# EAGLE design Adafruit TCS34725 (EAGLE 6.2)
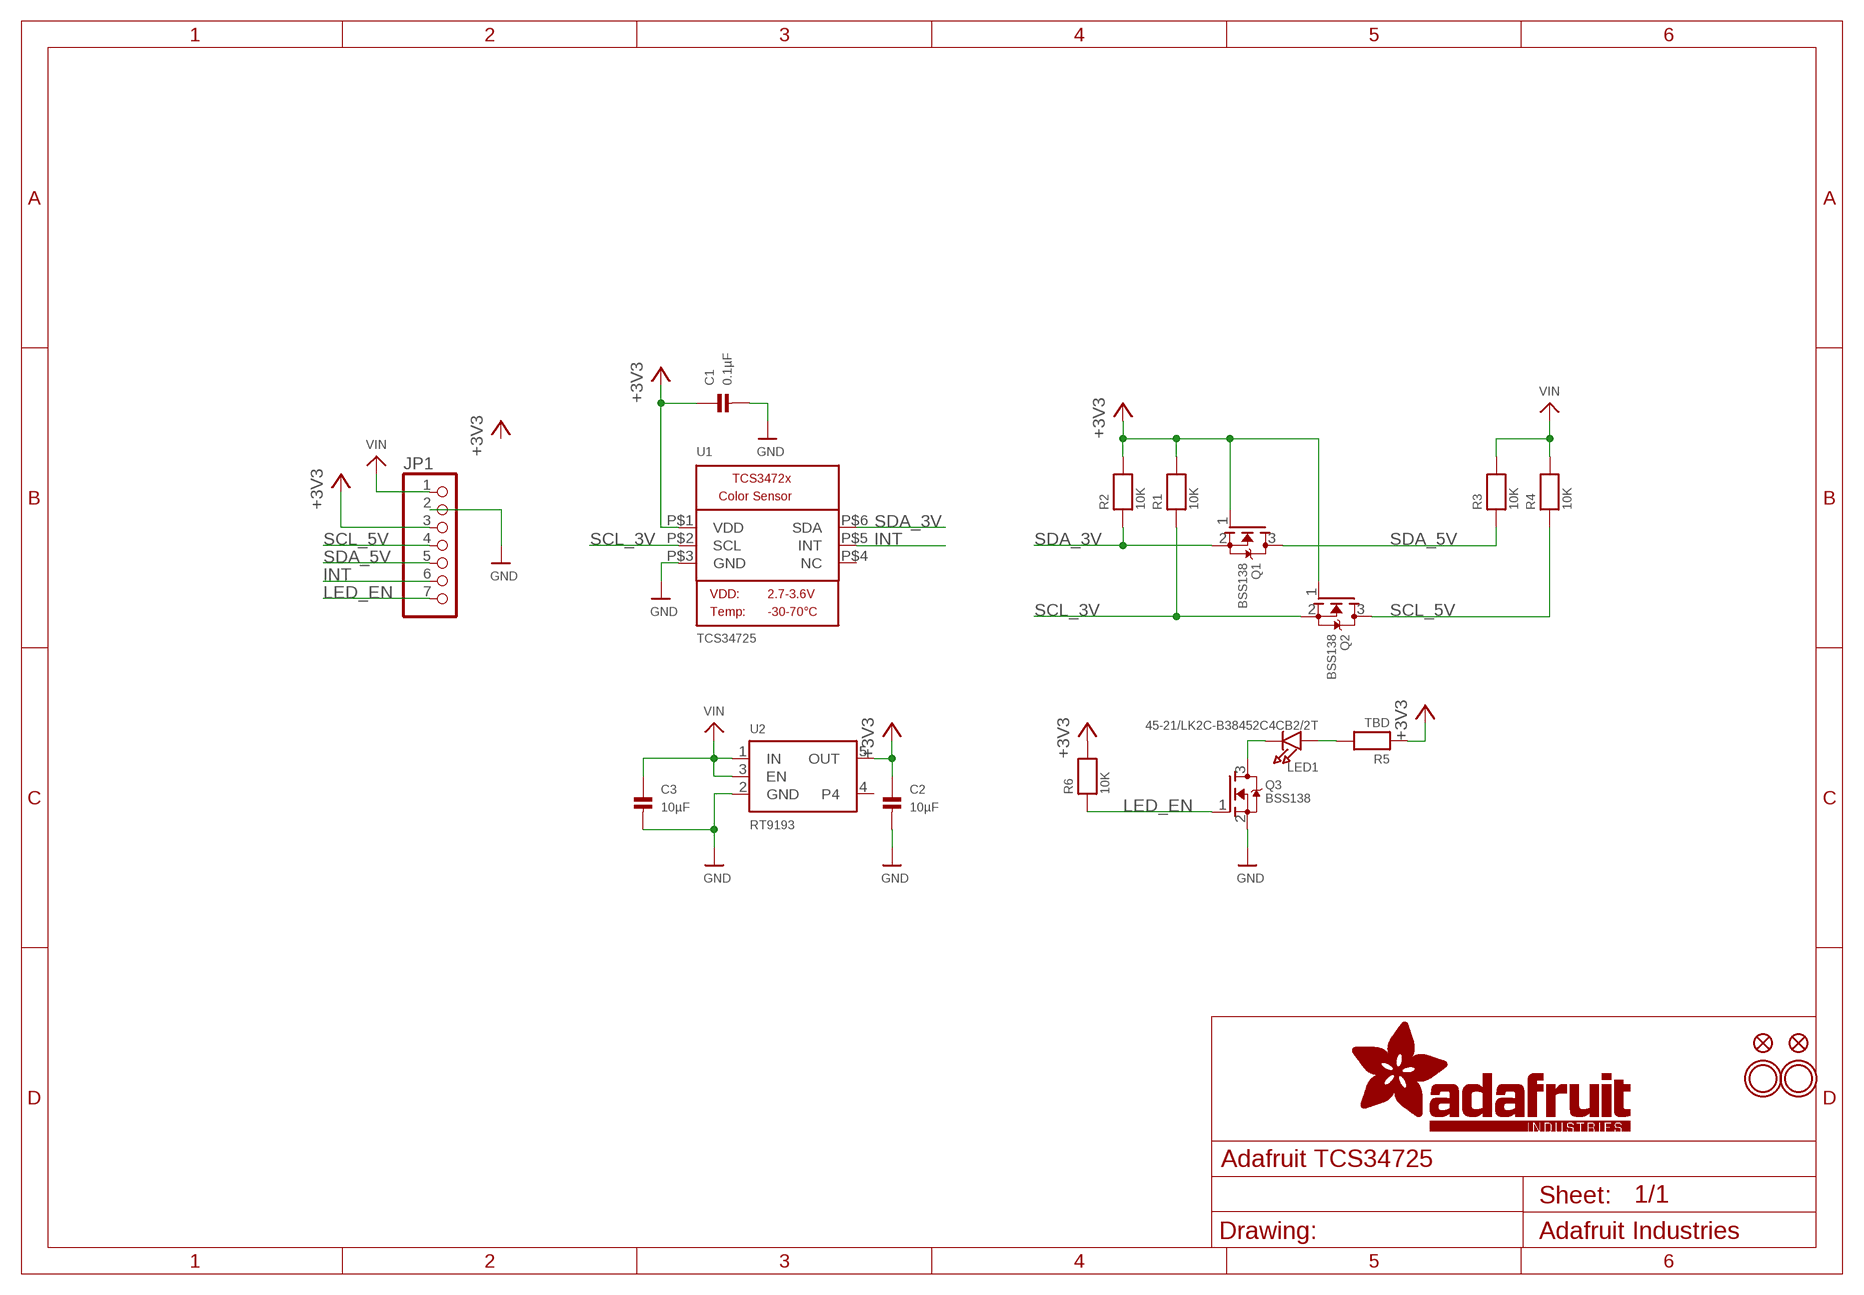
[diagram p0: schematic, sheet 1]

## Parts
C1  0.1µF  CAP_CERAMIC_0805  [_0805]
C2  10µF  CAP_CERAMIC_0805  [_0805]
C3  10µF  CAP_CERAMIC_0805  [_0805]
FID1  FIDUCIAL""  [FIDUCIAL_1MM]
FID2  FIDUCIAL""  [FIDUCIAL_1MM]
JP1  HEADER-1X770MIL  [1X07_ROUND_70]
LED1  45-21/LK2C-B38452C4CB2/2T  LEDEV45-21  [EVERLIGHT_45-21]
Q1  BSS138  MOSFET-NWIDE  [SOT23-WIDE]
Q2  BSS138  MOSFET-NWIDE  [SOT23-WIDE]
Q3  BSS138  MOSFET-NWIDE  [SOT23-WIDE]
R1  10K  RESISTOR_0805  [_0805]
R2  10K  RESISTOR_0805  [_0805]
R3  10K  RESISTOR_0805  [_0805]
R4  10K  RESISTOR_0805  [_0805]
R5  TBD  RESISTOR_0805  [_0805]
R6  10K  RESISTOR_0805  [_0805]
U1  TCS34725  LIGHT_TCS3472  [TCS3472_FN6]
U2  RT9193  VREG_SOT23-5  [SOT23-5]
U$8  MOUNTINGHOLE2.5  [MOUNTINGHOLE_2.5_PLATED]
U$14  MOUNTINGHOLE2.5  [MOUNTINGHOLE_2.5_PLATED]

## Nets
+3V3: C1.1 C2.1 JP1.3 Q1.1(G) Q2.1(G) R1.2 R2.2 R5.1 R6.2 U1.P$1(VDD) U2.5(OUT)
GND: C1.2 C2.2 C3.2 JP1.2 Q3.2(S) U1.P$3(GND) U2.2(GND)
INT: JP1.6 U1.P$5(INT)
LED_EN: JP1.7 Q3.1(G) R6.1
N$1: LED1.K(C) Q3.3(D)
N$2: LED1.A R5.2
SCL_3V: Q2.2(S) R1.1 U1.P$2(SCL)
SCL_5V: JP1.4 Q2.3(D) R4.1
SDA_3V: Q1.2(S) R2.1 U1.P$6(SDA)
SDA_5V: JP1.5 Q1.3(D) R3.1
VIN: C3.1 JP1.1 R3.2 R4.2 U2.1(IN) U2.3(EN)
Unconnected: U1.P$4(NC) U2.4

## Library data of the parts
C1-C3 = microbuilder:CAP_CERAMIC: Ceramic Capacitors 0402 - 0402 Surface Mount Capacitors 16pF 50V 5% [Digikey: 445-4899-2-ND] 18pF 50V 5% [Digikey: 490-1281-2-ND] 22pF 50V 5% [Digikey: 490-1283-2-ND] 68pF 50V 5% [Digikey: 490-1289-2-ND] 0.1uF 10V 10% [Digikey: 490-1318-2-ND] 1.0uF 6.3V 10% [Digikey: 490-1320-2-ND] 0603 - 0603 Surface Mount Capacitors 16 pF 50V 5% [Digikey: 445-5051-2-ND] 22 pF 50V [Digikey: PCC220ACVTR-ND] 33 pF 50V 5% [Digikey: 490-1415-1-ND] 56pF 50V 5% [Digikey: 490-1421-1-ND] 220pF 50V 5% [Digikey: 445-1285-1-ND] 680 pF 50V 2200 pF 50V 5% C0G [Digikey: 445-1297-1-ND] 5600 pF 100V 5% X7R [Digikey: 478-3711-1-ND] 0.1 µF 25V 10% [Digikey: PCC2277TR-ND] 0.22 µF 16V 10% X7R [Digikey: 445-1318-1-ND] 1.0 µF 25V 10% [Digikey: 445-5146-2-ND] 0603 - RF Specific 3pF 250V +/-0.1pF RF [Digikey: 712-1347-1-ND] 18 pF 250V 5% [Digikey: 478-3505-1-ND or 712-1322-1-ND] 56 pF 250V 5% C0G RF [Digikey: 490-4867-1-ND] 68 pF 250V RF [Digikey: 490-4868-1-ND] 0805 - 0805 Surface Mount Capacitors 220 pF 250V 2% RF Ceramic Capacitor [Digikey: 712-1398-1-ND] 1000 pF 50V 2% NP0 Ceramic Capacitor [Digikey: 478-3760-1-ND] 0.1 µF 25V 10% Ceramic Capacitor [Digikey: PCC1828TR-ND] 1.0 µF 16V 10% Ceramic Capacitor[Digikey: 490-1691-2-ND] 10.0 µF 10V 10% Ceramic Capacitor[Digikey: 709-1228-1-ND] 10.0 uF 16V 10% Ceramic Capacitor [Digikey: 478-5165-2-ND] 47 uF 6.3V 20% Ceramic Capacitor [Digikey: 587-1779-1-ND or 399-5506-1-ND] 1206 - 1206 Surface Mount Capacitors 47uF 10V 20% Ceramic Capacitor [Digikey: 490-5528-1-ND or 399-5508-1-ND or 445-6010-1-ND] 100uF 6.3V -20%, +80% Y5V Ceramic Capacitor (Digikey: 490-4512-1-ND, Mouser: 81-GRM31CF50J107ZE1L)
FID1 FID2 = microbuilder:FIDUCIAL: Fiducial Alignment Points Various fiducial points for machine vision alignment.
JP1 = microbuilder:HEADER-1X7: PIN HEADER
LED1 = microbuilder:LED: LED 0603 - 0603 Surface Mount Package 2mA: Green LED - Low Power (3.9mcd, 2ma, 1.7Vf) - Digikey: 475-2709-2-ND Orange LED - Low Power (9.8mcd, 2ma, 1.8Vf) - Digikey: 475-1194-2-ND Red LED - Low Power (5mcd, 2ma, 1.8Vf) - Digikey: 475-1195-2-ND Yellow LED - Low Power (7mcd, 2ma, 1.8Vf) - Digikey: 475-1196-2-ND 5mA: Blue LED - Low Power (17mcd, 5ma, 2.9Vf) - Digikey: LNJ937W8CRACT-ND 0805 - 0805 Surface Mount Package 2mA: Red LED (8.8mcd, 2mA, 1.8Vf, Clear) - Low Power [Digikey: 475-2510-1-ND] Green LED (5mcd, 2mA, 1.8Vf, Clear) - Low Power [Digikey: 475-2730-1-ND] Yellow LED (11.3mcd, 2mA, 1.8Vf, Clear) - Low Power [Digikey: 475-2555-1-ND] 20mA: Red LED (104mcd, 20mA, Diffused) - LS R976 [Digikey: 475-1278-6-ND] Red LED (12mcd, 20mA, 2.0Vf, Clear) - APT2012EC [Digikey: 754-1128-1-ND] Green LED (15mcd, 20mA, 2.2Vf, Clear) - APT2012GC [Digikey: 754-1131-1-ND] Orange LED (160mcd, 20mA, 2.1Vf, Clear) - APT2012SECK [Digikey: 754-1130-1-ND] 1206 - 1206 Surface Mount Package Green LED (26mcd, 20mA, Diffused) - LG N971 [Digikey: 475-1407-6-ND] Red LED (15mcd, 20mA, Diffused) - LH N974 [Digikey: 475-1416-6-ND] Cree - Cree High-Power Surface Mount LEDs XPEBWT-L1-0000-00D50 - White 111lm 350mA 2.9Vf 6200K 110° XTEAWT-00-0000-00000LEE3 - White 114lm 350mA 2.85Vf 5000K 115° Everlight - Everlight 45-21 Series Surface Mount LEDs 45-21/QK2C-B2832AC2CB2/2T - Warm White 2000mcd 20mA 3.25Vf 3050K 120° 45-21/LK2C-B38452C4CB2/2T - Nuetral White 2000mcd 20mA 3.25Vf 4150K 120° 45-21/LK2C-B50634C6CB2/2T - Cold White 2200mcd 20mA 3.25Vf 5650K 120°
Q1-Q3 = microbuilder:MOSFET-N: N-Channel Mosfet LEGEND VDS: Voltage Drain-Source ID: Drain Current RDS(ON): Drain-Source On-State Resistance VGS(TH): Gate-Source Threshold Voltage CISS: Drain-Source Input Capacitance SOT-23 Name VDS ID RDS(ON) VGS(TH) CISS Order Number 2N7002E 60V 260mA 2.5 Ohm 2.5V @ 250uA 26.7pF @ 25V 2N7002ET1GOSTR-ND BSH103 30V 850mA 400 mOhm 400mV @ 1mA 83pF @ 24V BSH103,235-ND BSS138 60V 320mA 1.6 Ohm 1.5V @ 250uA 50pF @ 10V Mouser: 771-BSS138PW115 DMN2075U-7 20V 4.2A 38 mOhm 1V @ 250 uA 594.3pF @ 10V DMN2075U-7DICT-ND * BSS138 good choice for I2C level-shifting
R1-R6 = microbuilder:RESISTOR: Resistors 0402 - 0402 Surface Mount Package 22 Ohm 1% 1/16W [Digikey: 311-22.0LRTR-ND] 33 Ohm 5% 1/16W 1.0K 5% 1/16W 1.5K 5% 1/16W 2.0K 1% 1/16W 10.0K 1% 1/16W [Digikey: 311-10.0KLRTR-ND] 10.0K 5% 1/16W [Digikey: RMCF0402JT10K0TR-ND] 12.1K 1% 1/16W [Digikey: 311-22.0LRTR-ND] 100.0K 5% 1/16W 0603 - 0603 Surface Mount Package 0 Ohm 1/10 Watt 1% Resistor 15 Ohm 1/10 Watt 1% Resistor 33 Ohm 1/10 Watt 1% Resistor 49.9 Ohm 1/10 Watt 1% Resistor 100 Ohm 1/10 Watt 1% Resistor 150 Ohm 1/10 Watt 1% Resistor 240 Ohm 1/10 Watt 1% Resistor 390 Ohm 1/10 Watt 1% Resistor 560 Ohm 1/10 Watt 1% Resistor 680 Ohm 1/10 Watt 1% Resistor 750 Ohm 1/10 Watt 1% Resistor 1.0K Ohm 1/10 Watt 1% Resistor 1.5K Ohm 1/10 Watt 1% Resistor 2.0K Ohm 1/10 Watt 1% Resistor 2.2K Ohm 1/10 Watt 1% Resistor 3.3K Ohm 1/10 Watt 1% Resistor 4.7K Ohm 1/10 Watt 1% Resistor 10.0K Ohm 1/10 Watt 1% Resistor 12.0K Ohm 1/10 Watt 1% Resistor 12.1K Ohm 1/10 Watt 1% Resistor 20.0K Ohm 1/10 Watt 1% Resistor 33.0K Ohm 1/10 Watt 1% Resistor 100.0K Ohm 1/10 Watt 1% Resistor 0805 - 0805 Surface Mount Package 0 Ohm 1/8 Watt 1% Resistor 33 Ohm 1/8 Watt 1% Resistor 100 Ohm 1/8 Watt 1% Resistor 150 Ohm 1/8 Watt 1% Resistor 200 Ohm 1/8 Watt 1% Resistor 240 Ohm 1/8 Watt 1% Resistor 330 Ohm 1/8 Watt 1% Resistor 390 Ohm 1/8 Watt 1% Resistor 470 Ohm 1/8 Watt 1% Resistor 1.0K Ohm 1/8 Watt 1% Resistor 1.5K Ohm 1/8 Watt 1% Resistor 2.0K Ohm 1/8 Watt 1% Resistor 4.7K Ohm 1/8 Watt 1% Resistor 5.1K Ohm 1/8 Watt 1% Resistor 5.6K Ohm 1/8 Watt 1% Resistor 10.0K Ohm 1/8 Watt 1% Resistor 22.0K Ohm 1/8 Watt 1% Resistor 33.0K Ohm 1/8 Watt 1% Resistor 100K Ohm 1/8 Watt 1% Resistor 1206 - 1206 Surface Mount Package 2012 - 2010 Surface Mount Package 0.11 Ohm 1/2 Watt 1% Resistor - Digikey: RHM.11UCT-ND
U1 = microbuilder:LIGHT_TCS3472: TCS3472 RGB + Clear Color Sensor VDD: 2.7-3.6V Temp: -30 - 70°C IR light blocking filter 3,800,000:1 Dynamic Range 2.5µA sleep state Part IDs TCS34725: I2C bus logic = VDD, I2C address: 0x29 TCS34727: I2C bus logic = 1.8V, I2C address: 0x29
U2 = microbuilder:VREG_SOT23-5: SOT23-5 Fixed Voltage Regulators To better organise some of the SOT23-5 fixed voltage regulators in this library, this new part was created. Part Current Out V Out V In V Dropout Digikey Part No. ADP121 150mA 3.3V 3.4-5.5V 0.09V @ 150mA ADP121-AUJZ33R7CT-ND ADP121 150mA 3.0V 3.1-5.5V 0.09V @ 150mA ADP121-AUJZ30R7CT-ND ADP122 300mA 3.3V 3.4-5.5V 0.085V @ 300mA ADP122AUJZ-3.3-R7CT-ND ADP1712 300mA 3.3V 3.5-5.5V 0.17V @ 300mA ADP1712AUJZ-3.3-R7TR-ND AP7311 (Low Cost) 150mA 3.3V 3.5-6V 0.15V @ 150mA AP7311-33WG-7DICT-ND LD39015M18R 150mA 1.8V 1.9V-5.5V 0.08V @ 100mA 497-6977-1-ND MCP1824T-3302E/OT 300mA 3.3V 3.5V-6V 0.2V @ 300mA MCP1824T-3302E/OTCT-ND MIC5205-2.5YM5 TR 150mA 2.5V 2.7-16V 0.165V @ 150mA 576-1257-2-ND MIC5205-3.0YM5 TR 150mA 3.0V 3.2V-16V 0.165V @ 150mA 576-1258-2-ND MIC5205-3.3YM5 TR 150mA 3.3V 3.5V-16V 0.165V @ 150mA 576-1259-2-ND TPS780330220 150mA 3.3V+2.2V 3.6-5.5V 250mV Max 296-23332-1-ND TDA3663/N1,135 100mA 3.3V 3.5-45V 0.18V @ 50mA 568-5343-1-ND
U$8 U$14 = microbuilder:MOUNTINGHOLE: Mounting Hole For #2 screws (0.086"/2.18mm width, 0.094"/2.4mm hole) use 2.5mm

## Board
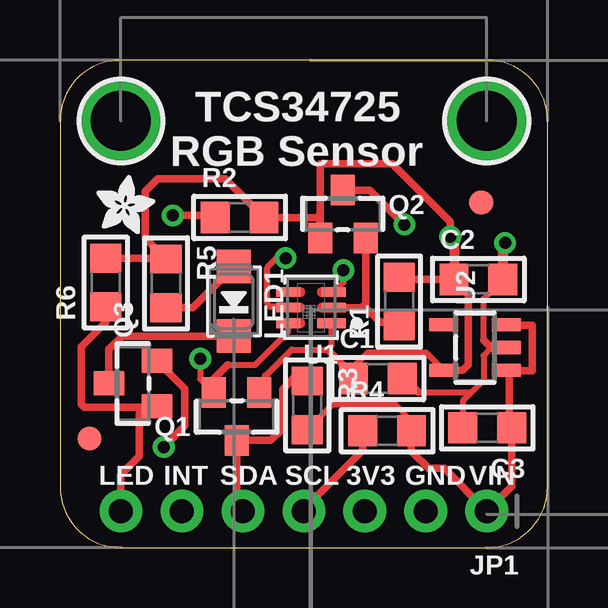
[diagram p1: board, top side]
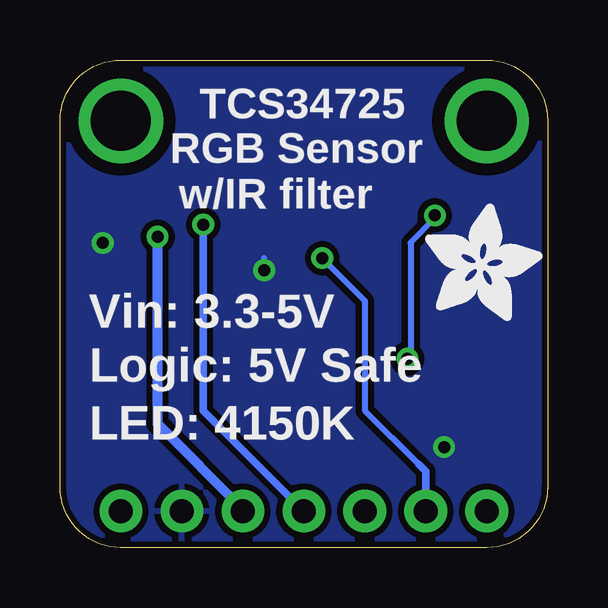
[diagram p2: board, bottom side, seen from below]

Size 20.32 x 20.32 mm. Coordinates in mm from the lower left corner, seen from the top.
Outline: 2.54,0 17.78,0 arc90 20.32,2.54 20.32,17.78 arc90 17.78,20.32 2.54,20.32 arc90 0,17.78 0,2.54 arc90 2.54,0
Copper layers (1*16): Top 0.035mm / dielectric 1.5mm / Bottom 0.035mm
Design rules "default": minimum track width 8mil, minimum drill 16mil, track to track 8mil, track to pad 8mil, pad to pad 8mil, via to via 8mil, smd to smd 8mil, copper to edge 10mil, drill to drill 8mil, minimum pad ring 10mil, minimum via ring 8mil, stop-mask expansion 4mil, vias tented up to drill 20mil, thermal gap 10mil

### Footprints (pad centres in the part's own frame; a part is rotated, then mirrored left to right if it is on the bottom)
_0805 = smd 1.2 x 1.3: 1 -1.016,0; 2 1.016,0
FIDUCIAL_1MM = smd 1 x 1: 1 0,0
1X07_ROUND_70 = drill 1 pad 1.778: 1 -7.62,0; 2 -5.08,0; 3 -2.54,0; 4 0,0; 5 2.54,0; 6 5.08,0; 7 7.62,0
EVERLIGHT_45-21 = smd 1.4 x 1.4: A -1.45,0; K 1.45,0
SOT23-WIDE = smd 1 x 1.27: 1 -0.95,-1; 2 0.95,-1; 3 0,1
TCS3472_FN6 = smd 1.2 x 0.4: P$1 -0.85,0.65 | smd 1 x 0.4: P$2 -0.95,0; P$3 -0.95,-0.65; P$4 0.95,-0.65; P$5 0.95,0; P$6 0.95,0.65
SOT23-5 = smd 0.55 x 1.2: 1 -0.95,-1.3; 2 0,-1.3; 3 0.95,-1.3; 4 0.95,1.3; 5 -0.95,1.3
MOUNTINGHOLE_2.5_PLATED = drill 2.5 pad 3.2: P$1 0,0

### Placement (x,y rotation side)
C1  13.24,7.05 0 top
C2  17.43,11.18 0 top
C3  17.8,4.99 180 top
FID1  17.55,14.38 180 top
FID2  1.23,4.54 180 top
JP1  10.16,1.52 180 top
LED1  7.24,10.26 270 top
Q1  7.36,5.47 180 top
Q2  11.78,13.9 0 top
Q3  3.04,6.84 90 top
R1  14.13,10.25 90 top
R2  7.49,13.76 0 top
R3  10.3,5.93 270 top
R4  13.63,4.87 0 top
R5  4.42,11.02 270 top
R6  1.91,11.05 90 top
U1  10.46,10 180 top
U2  17.29,8.34 90 top
U$2  [ADAFRUIT_2.5MM]  1.52,13.08 0 top
U$8  2.54,17.78 180 top
U$14  17.78,17.78 180 top
U$18  [ADAFRUIT_5MM]  5.1,9.46 0 bottom

### Tracks (layer width: path | path; a pad name or v marks a point on that pad's centre or on a via)
+3V3  (via drill 0.5)
  Top 0.254: 8.56,7.17 9.65,8.26 11.15,8.26 11.31,8.42 U1.P$1 | U2.5 15.26,8.13 12.83,8.13 12.32,7.62 12.23,7.49 C1.1
  Top 0.305: R1.2 14.22,11.18 C2.1 17.02,10.58 17.02,7.62 16.79,7.39 U2.5 | 10.83,13.68 Q2.1 10.83,13.84 | 10.83,13.84 10.83,16 13.84,16 16.26,13.59 v16.26,12.95 | R6.2 4.38,12.06 R5.1 3.56,12.89 3.56,14.86 4.06,15.37 6.89,15.37 R2.2 10.71,13.76 10.79,13.84 10.83,13.84 | 8.56,7.17 8.56,6.72 Q1.1 | 11.15,8.26 12.35,7.05 C1.1
  Top 0.406: v16.26,12.95 16.42,12.79 C2.1
  Bottom 0.406: v16.26,12.95 16.26,5.16 12.7,1.6 JP1.3
GND  (via drill 0.5)
  Top 0.254: 17.14,6.48 17.65,6.99 17.65,8 17.99,8.34 18.07,8.34 U2.2 | 17.14,6.48 16.79,6.12 C3.2 | 14.96,6.48 17.14,6.48 | 17.65,8.64 17.65,10.38 C2.2 | U1.P$3 11.81,11.05 v11.81,11.56
  Top 0.305: Q3.2 5.21,6.63 5.21,5.08 v4.32,4.19 | 18.07,8.34 17.95,8.34 17.65,8.64 | 14.96,6.48 14.51,6.92 C1.2
  Top 0.406: v18.54,12.7 18.45,12.61 C2.2
  Bottom 0.254: v11.81,11.56 11.81,12.06
  Bottom 0.305: v4.32,4.19 4.19,4.06 4.45,4.06
  pour Bottom (isolate 0.254): 20.29,-0.13 2.52,-0.02 arc-90 0,2.52 0,20.38 20.29,20.25
INT  (via drill 0.5)
  Top 0.254: U1.P$5 9.48,10.03 8.76,10.03 8.64,10.16 8.64,11.68 9.02,12.06 v9.4,12.06
  Bottom 0.254: v9.4,12.06 7.62,10.29 7.62,5.71 5.38,3.48
  Bottom 0.305: 5.38,3.48 5.08,3.17 JP1.6
LED_EN
  Top 0.305: Q3.1 3.99,5.84 3.56,5.84 | 3.56,5.84 1.02,5.84 0.89,5.97 0.89,8.38 1.91,9.4 R6.1 | JP1.7 2.54,3.05 3.3,3.81 3.3,5.59 3.56,5.84
N$1
  Top 0.305: Q3.3 2.04,8.26 2.59,8.81 LED1.K
N$2
  Top 0.305: R5.2 5.53,10 LED1.A
SCL_3V
  Top 0.305: U1.P$2 12.57,10 | 12.57,10 12.73,10 13.34,9.4 14.29,9.4 R1.1 | Q2.2 12.73,10.16 12.57,10
SCL_5V  (via drill 0.5)
  Top 0.305: R4.1 12.61,4.05 10.16,1.6 JP1.4 | Q2.3 12.91,14.9 v14.35,13.46
  Bottom 0.305: v14.35,13.46 14.35,5.71 JP1.4
SDA_3V  (via drill 0.5)
  Top 0.254: 6.41,6.54 Q1.2 5.84,7.04 v5.84,7.87 | 6.99,7.62 8.13,7.62 9.51,9 U1.P$6
  Top 0.305: 6.99,7.62 6.41,7.04 Q1.2 | v4.7,13.84 6.38,13.84 R2.1
  Bottom 0.254: v4.7,13.84 4.7,13.72 5.71,12.7 5.71,8 v5.84,7.87
SDA_5V
  Top 0.305: R3.1 10.14,7.11 9.78,7.11 9.27,6.6 9.27,4.95 8.79,4.47 Q1.3 7.36,1.78 JP1.5
VIN
  Top 0.254: R3.2 11.36,5.97 13.97,5.97 14.64,5.3 R4.2
  Top 0.305: R4.2 14.64,4.03 15.37,3.3 16,3.3 JP1.1 18.82,2.56 C3.1 18.72,5.09 18.72,7.26 U2.1 18.62,7.37 19.68,7.37 19.68,9.27 18.95,9.27 18.93,9.29 U2.3

### Text on the board
tPlace: TCS34725 | RGB Sensor | LED | INT | SDA | SCL | 3V3 | GND | VIN
bPlace: TCS34725 | RGB Sensor | w/IR filter | Vin: 3.3-5V | Logic: 5V Safe | LED: 4150K